# Altium schematic sheet MCU.SchDoc
size A3
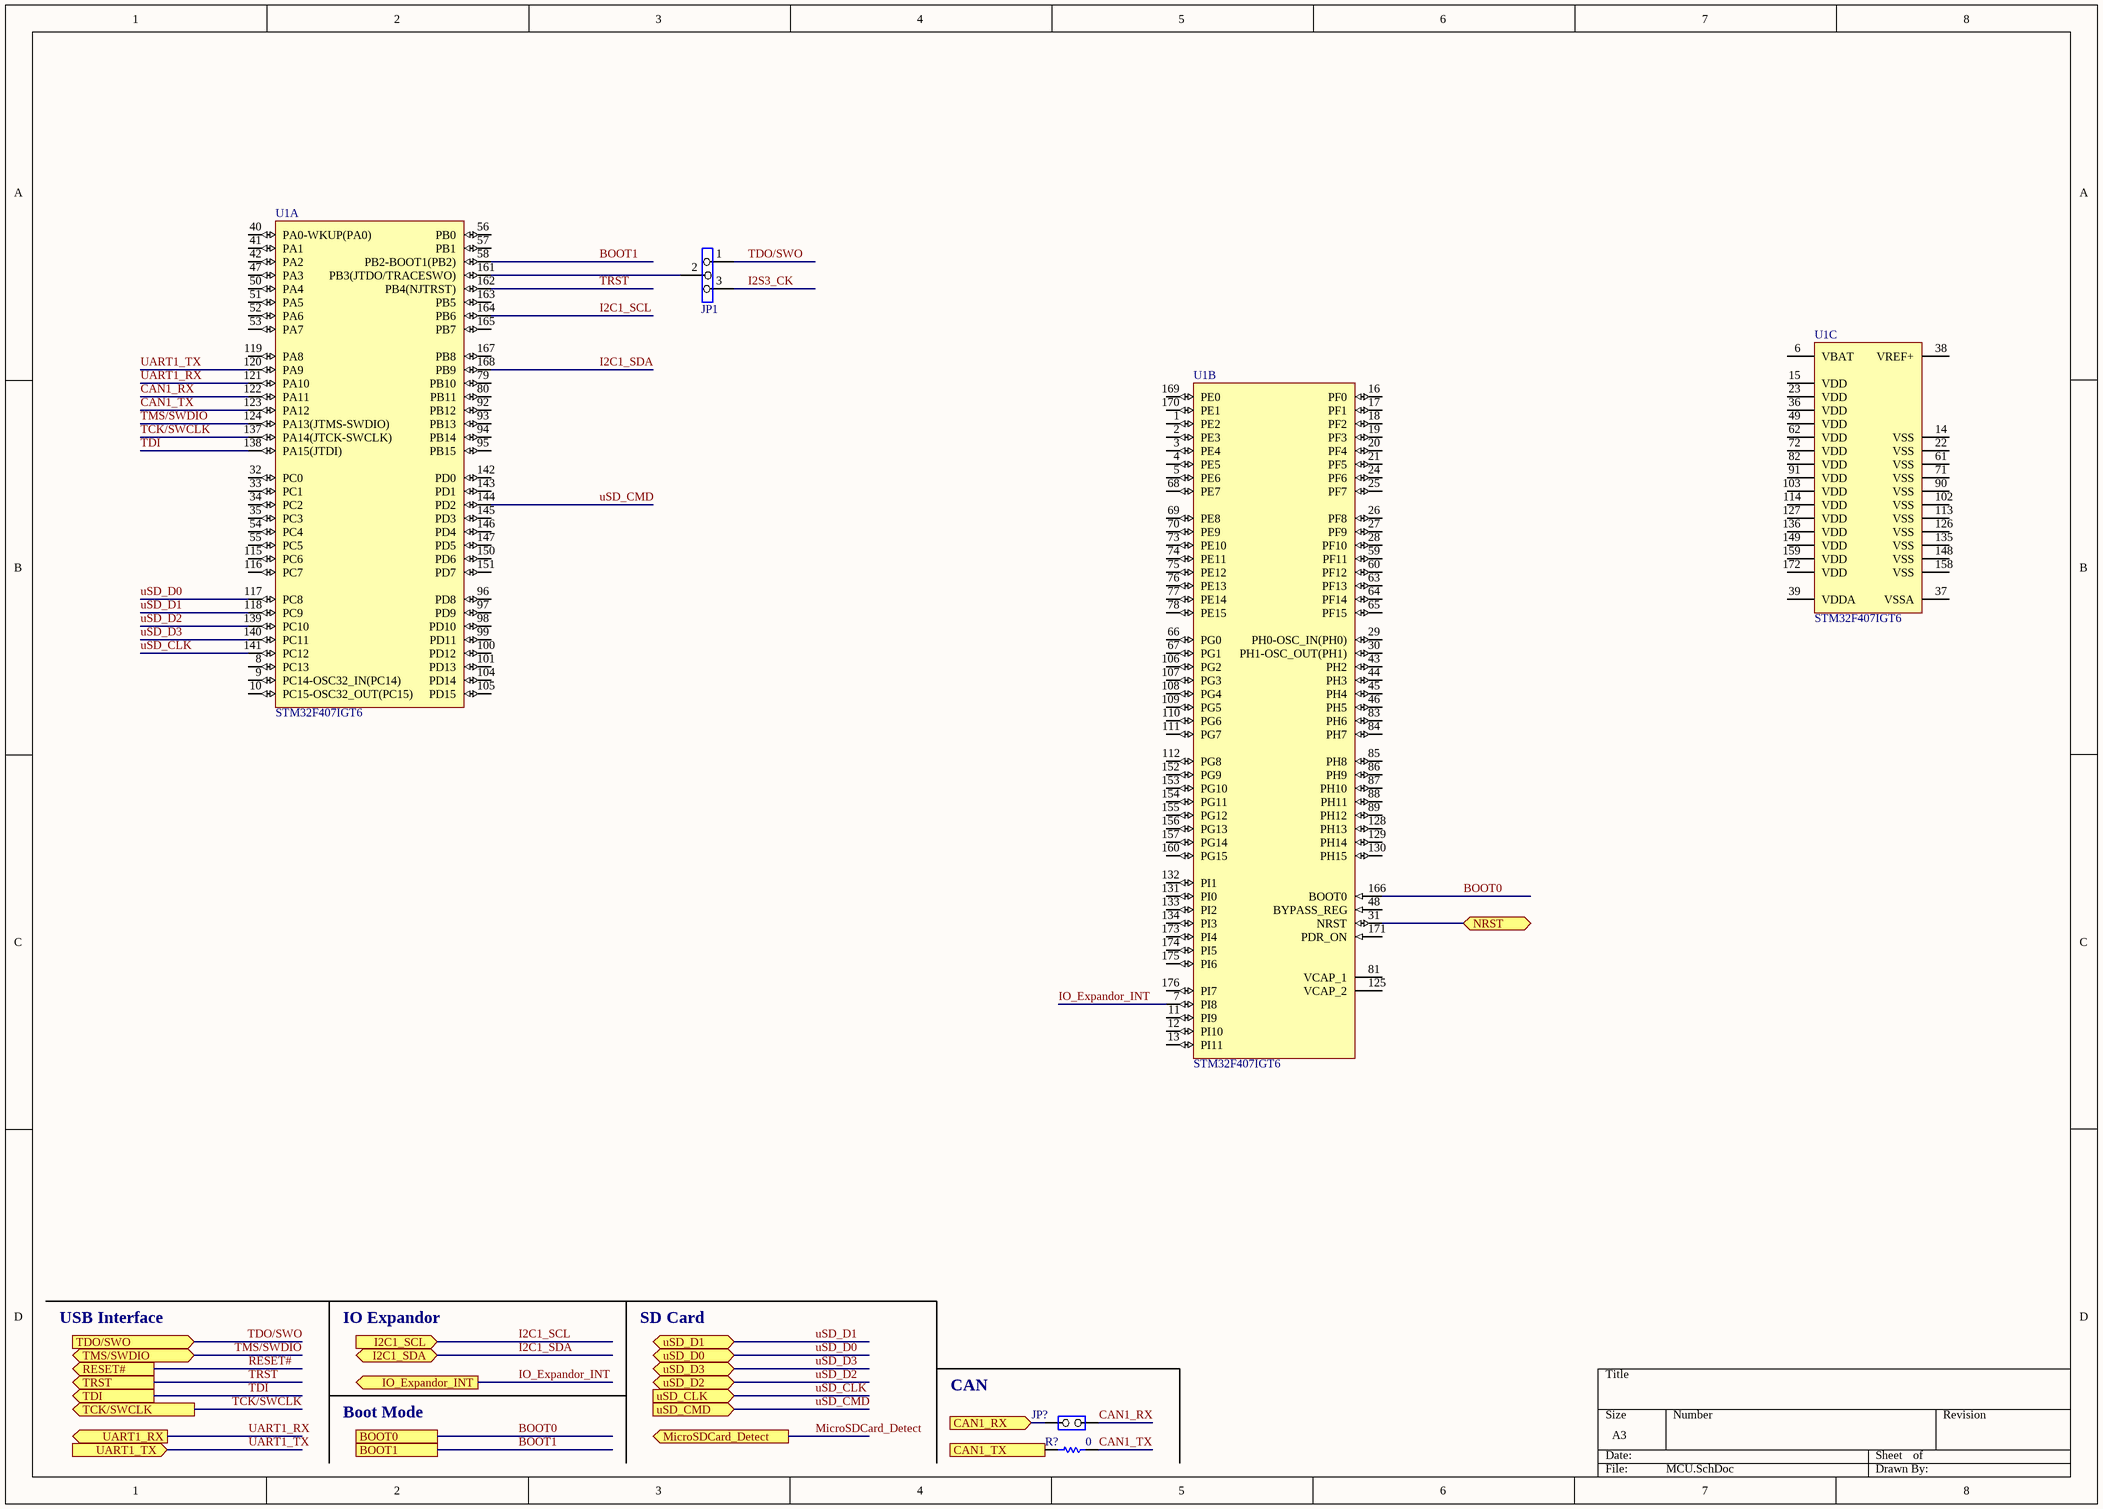
[diagram p0: MCU.SchDoc]

## Parts
JP1  (no value)  [SIP3]
JP?  (no value)  [SIP2]
R?  0  [0603R]
U1  STM32F407IGT6  [STM-LQFP176_M]  (parts A,B,C of 3)

## Ports
BOOT0, BOOT1, CAN1_RX (in), CAN1_TX (out), I2C1_SCL (in), I2C1_SDA (bidir), IO_Expandor_INT (out), MicroSDCard_Detect (out), NRST (bidir), RESET# (out), TCK/SWCLK (out), TDI (out), TDO/SWO (in), TMS/SWDIO (bidir), TRST (out), UART1_RX (out), UART1_TX (in), uSD_CLK (in), uSD_CMD (in), uSD_D0 (bidir), uSD_D1 (bidir), uSD_D2 (bidir), uSD_D3 (bidir)

## Nets
BOOT0: U1.166(BOOT0) ; port BOOT0
BOOT1: U1.58(PB2-BOOT1(PB2)) ; port BOOT1
CAN1_RX: JP?.1(COMMON) U1.122(PA11)
CAN1_RX: JP?.2(NO) ; port CAN1_RX  [a separate net that carries the same name]
CAN1_TX: R?.1 U1.123(PA12)
CAN1_TX: R?.2 ; port CAN1_TX  [a separate net that carries the same name]
I2C1_SCL: U1.164(PB6) ; port I2C1_SCL
I2C1_SDA: U1.168(PB9) ; port I2C1_SDA
I2S3_CK: JP1.3
IO_Expandor_INT: U1.7(PI8) ; port IO_Expandor_INT
MicroSDCard_Detect: port MicroSDCard_Detect
NRST: U1.31(NRST) ; port NRST
RESET#: port RESET#
TCK/SWCLK: U1.137(PA14(JTCK-SWCLK)) ; port TCK/SWCLK
TDI: U1.138(PA15(JTDI)) ; port TDI
TDO/SWO: JP1.1 ; port TDO/SWO
TMS/SWDIO: U1.124(PA13(JTMS-SWDIO)) ; port TMS/SWDIO
TRST: U1.162(PB4(NJTRST)) ; port TRST
UART1_RX: U1.121(PA10) ; port UART1_RX
UART1_TX: U1.120(PA9) ; port UART1_TX
uSD_CLK: U1.141(PC12) ; port uSD_CLK
uSD_CMD: U1.144(PD2) ; port uSD_CMD
uSD_D0: U1.117(PC8) ; port uSD_D0
uSD_D1: U1.118(PC9) ; port uSD_D1
uSD_D2: U1.139(PC10) ; port uSD_D2
uSD_D3: U1.140(PC11) ; port uSD_D3
NetJP1_2: JP1.2 U1.161(PB3(JTDO/TRACESWO))

Not connected (* = marked no-connect by the designer): U1 1(PE2) 2(PE3) 3(PE4) 4(PE5) 5(PE6) 6(VBAT) 8(PC13) 9(PC14-OSC32_IN(PC14)) 10(PC15-OSC32_OUT(PC15)) 11(PI9) 12(PI10) 13(PI11) 14(VSS) 15(VDD) 16(PF0) 17(PF1) 18(PF2) 19(PF3) 20(PF4) 21(PF5) 22(VSS) 23(VDD) 24(PF6) 25(PF7) 26(PF8) 27(PF9) 28(PF10) 29(PH0-OSC_IN(PH0)) 30(PH1-OSC_OUT(PH1)) 32(PC0) 33(PC1) 34(PC2) 35(PC3) 36(VDD) 37(VSSA) 38(VREF+) 39(VDDA) 40(PA0-WKUP(PA0)) 41(PA1) 42(PA2) 43(PH2) 44(PH3) 45(PH4) 46(PH5) 47(PA3) 48(BYPASS_REG) 49(VDD) 50(PA4) 51(PA5) 52(PA6) 53(PA7) 54(PC4) 55(PC5) 56(PB0) 57(PB1) 59(PF11) 60(PF12) 61(VSS) 62(VDD) 63(PF13) 64(PF14) 65(PF15) 66(PG0) 67(PG1) 68(PE7) 69(PE8) 70(PE9) 71(VSS) 72(VDD) 73(PE10) 74(PE11) 75(PE12) 76(PE13) 77(PE14) 78(PE15) 79(PB10) 80(PB11) 81(VCAP_1) 82(VDD) 83(PH6) 84(PH7) 85(PH8) 86(PH9) 87(PH10) 88(PH11) 89(PH12) 90(VSS) 91(VDD) 92(PB12) 93(PB13) 94(PB14) 95(PB15) 96(PD8) 97(PD9) 98(PD10) 99(PD11) 100(PD12) 101(PD13) 102(VSS) 103(VDD) 104(PD14) 105(PD15) 106(PG2) 107(PG3) 108(PG4) 109(PG5) 110(PG6) 111(PG7) 112(PG8) 113(VSS) 114(VDD) 115(PC6) 116(PC7) 119(PA8) 125(VCAP_2) 126(VSS) 127(VDD) 128(PH13) 129(PH14) 130(PH15) 131(PI0) 132(PI1) 133(PI2) 134(PI3) 135(VSS) 136(VDD) 142(PD0) 143(PD1) 145(PD3) 146(PD4) 147(PD5) 148(VSS) 149(VDD) 150(PD6) 151(PD7) 152(PG9) 153(PG10) 154(PG11) 155(PG12) 156(PG13) 157(PG14) 158(VSS) 159(VDD) 160(PG15) 163(PB5) 165(PB7) 167(PB8) 169(PE0) 170(PE1) 171(PDR_ON) 172(VDD) 173(PI4) 174(PI5) 175(PI6) 176(PI7)

## Notes on the sheet
- USB Interface
- IO Expandor
- SD Card
- CAN
- Boot Mode

## Library data of the parts
JP1 = Jumper3
JP? = JP2
R? = Res1: Resistor; Value: 1K; Published: 8-Jun-2000; Revision: July-2002: Re-released for DXP Platform.; Publisher: Altium Limited
U1 = CMP-0243-00010-3: ARM Cortex-M4 32-bit MCU+FPU, 210 DMIPS, 1024 kB Flash, 192 kB Internal RAM, 140 I/Os, 176-pin LQFP, -40 to 85 degC, Tray; Manufacturer: STMicroelectronics; Internal RAM Size (kB): 192; Operating Frequency(F) (Processor speed) (MHz): 168; D/A Converter: 2x12-bit; FLASH Size (Prog) (kB): 1024; Supply Voltage(Vcc) max (V): 3.6; Supply Voltage(Vcc) min (V): 1.8; I/Os (High Current): 140; Packing: Tray; ComponentLink2Description: Datasheet; ComponentLink1Description: Manufacturer URL; DatasheetVersion: Rev. 4; PackageReference: LQFP176; PackageVersion: Rev. 4, 06/2013; ComponentLink1URL: http://www.st.com/web/en/home.html; ComponentLink3URL: http://www.st.com/st-web-ui/static/active/en/resource/technical/document/datasheet/DM00035129.pdf; ComponentLink2URL: http://www.st.com/st-web-ui/static/active/en/resource/technical/document/datasheet/DM00037051.pdf; Mounting Technology: Surface Mount; PartNumber: STM32F407IGT6; Core: ARM Cortex-M4; PackageDescription: 176-Pin Low Profile Quad Flat Package, 24 x 24 mm Body, 0.5 mm Pitch; ComponentLink3Description: Package Specification